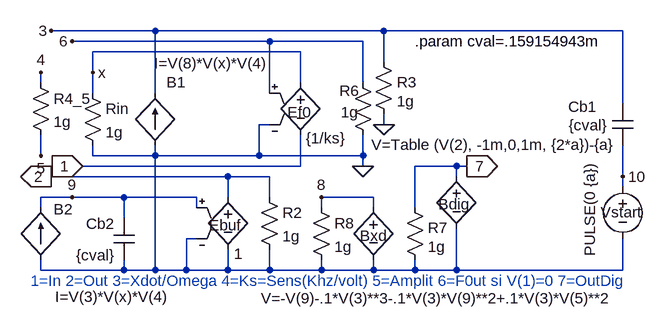
[diagram p0: schematic vcodig.asc]
vcodig.asc, the LTspice schematic file:
Version 4
SHEET 1 1184 680
WIRE -240 208 -240 192
WIRE -240 320 -240 288
WIRE -240 400 -240 384
WIRE -240 496 -240 480
WIRE -192 384 -240 384
WIRE -160 192 -160 160
WIRE -160 224 -160 192
WIRE -160 320 -160 304
WIRE -112 384 -192 384
WIRE -112 416 -112 384
WIRE -112 496 -240 496
WIRE -112 496 -112 480
WIRE -64 128 -224 128
WIRE -64 224 -64 128
WIRE -64 320 -160 320
WIRE -64 320 -64 304
WIRE -64 496 -112 496
WIRE -64 496 -64 320
WIRE -16 496 -64 496
WIRE -16 496 -16 448
WIRE 0 384 -112 384
WIRE 0 400 0 384
WIRE 0 448 -16 448
WIRE 48 352 -224 352
WIRE 48 384 48 352
WIRE 48 496 -16 496
WIRE 48 496 48 464
WIRE 96 320 -64 320
WIRE 96 320 96 272
WIRE 112 144 -192 144
WIRE 112 224 112 144
WIRE 112 272 96 272
WIRE 112 352 48 352
WIRE 112 384 112 352
WIRE 112 496 48 496
WIRE 112 496 112 464
WIRE 160 160 -160 160
WIRE 160 208 160 160
WIRE 160 336 -176 336
WIRE 160 336 160 288
WIRE 192 400 192 384
WIRE 192 496 112 496
WIRE 192 496 192 480
WIRE 256 144 112 144
WIRE 256 208 256 144
WIRE 256 320 96 320
WIRE 256 320 256 288
WIRE 256 336 256 320
WIRE 272 384 192 384
WIRE 272 400 272 384
WIRE 272 496 192 496
WIRE 272 496 272 480
WIRE 288 128 -64 128
WIRE 288 176 288 128
WIRE 288 272 288 256
WIRE 336 400 336 336
WIRE 336 496 272 496
WIRE 336 496 336 480
WIRE 400 336 336 336
WIRE 400 352 400 336
WIRE 400 496 336 496
WIRE 400 496 400 432
WIRE 416 336 400 336
WIRE 656 128 288 128
WIRE 656 240 656 128
WIRE 656 352 656 304
WIRE 656 368 656 352
WIRE 656 496 400 496
WIRE 656 496 656 448
FLAG 256 336 0
FLAG -176 336 1
IOPIN -176 336 In
FLAG -224 128 3
FLAG -192 384 9
FLAG 192 384 8
FLAG -224 352 2
IOPIN -224 352 Out
FLAG 656 352 10
FLAG -240 192 4
FLAG -240 320 5
FLAG -192 144 6
FLAG -160 192 x
FLAG 416 336 7
IOPIN 416 336 Out
FLAG 288 272 0
SYMBOL res -176 208 R0
SYMATTR InstName Rin
SYMATTR Value 1g
SYMBOL res 96 368 R0
SYMATTR InstName R2
SYMATTR Value 1g
SYMBOL bi -64 304 R180
WINDOW 0 -47 97 Left 0
WINDOW 3 -173 126 Left 0
SYMATTR InstName B1
SYMATTR Value I=V(8)*V(x)*V(4)
SYMBOL bi -240 480 R180
WINDOW 0 -49 78 Left 0
WINDOW 3 -197 -57 Left 0
SYMATTR InstName B2
SYMATTR Value I=V(3)*V(x)*V(4)
SYMBOL cap -128 416 R0
WINDOW 3 -58 57 Left 0
WINDOW 0 -42 9 Left 0
SYMATTR Value {cval}
SYMATTR InstName Cb2
SYMATTR SpiceLine Rpar=1g
SYMBOL bv 272 384 R0
WINDOW 0 -21 59 Left 0
WINDOW 3 -173 155 Left 0
SYMATTR InstName Bxd
SYMATTR Value V=-V(9)-.1*V(3)**3-.1*V(3)*V(9)**2+.1*V(3)*V(5)**2
SYMBOL res 176 384 R0
SYMATTR InstName R8
SYMATTR Value 1g
SYMBOL e 48 368 R0
WINDOW 0 -29 59 Left 0
WINDOW 3 9 103 Left 0
SYMATTR InstName Ebuf
SYMATTR Value 1
SYMBOL voltage 656 352 R0
WINDOW 0 -34 55 Left 0
WINDOW 3 -51 -22 VRight 0
WINDOW 123 0 0 Left 0
WINDOW 39 0 0 Left 0
SYMATTR InstName Vstart
SYMATTR Value PULSE(0 {a})
SYMBOL cap 640 240 R0
WINDOW 0 -68 5 Left 0
WINDOW 3 -8 33 Right 0
SYMATTR InstName Cb1
SYMATTR Value {cval}
SYMBOL res -256 192 R0
SYMATTR InstName R4_5
SYMATTR Value 1g
SYMBOL res 240 192 R0
WINDOW 0 -20 28 Left 0
WINDOW 3 -18 61 Left 0
SYMATTR InstName R6
SYMATTR Value 1g
SYMBOL e 160 192 R0
WINDOW 0 -20 61 Left 0
WINDOW 3 8 101 Left 0
SYMATTR InstName Ef0
SYMATTR Value {1/ks}
SYMBOL bv 400 336 R0
WINDOW 0 -28 59 Left 0
WINDOW 3 -131 -33 Left 0
SYMATTR InstName Bdig
SYMATTR Value V=Table (V(2), -1m,0,1m, {2*a})-{a}
SYMBOL res 320 384 R0
WINDOW 0 36 47 Left 0
SYMATTR InstName R7
SYMATTR Value 1g
SYMBOL res 272 160 R0
WINDOW 0 36 47 Left 0
SYMATTR InstName R3
SYMATTR Value 1g
TEXT -256 512 Left 0 ;1=In 2=Out 3=Xdot/Omega 4=Ks=Sens(Khz/volt) 5=Amplit 6=F0ut si V(1)=0 7=OutDig
TEXT 336 144 Left 0 !.param cval=.159154943m

The netlist it stands for:
* vcodig.asc
Rin x 0 1g
R2 2 0 1g
B1 0 3 I=V(8)*V(x)*V(4)
B2 0 9 I=V(3)*V(x)*V(4)
Cb2 9 0 {cval} Rpar=1g
Bxd 8 0 V=-V(9)-.1*V(3)**3-.1*V(3)*V(9)**2+.1*V(3)*V(5)**2
R8 8 0 1g
Ebuf 2 0 9 0 1
Vstart 10 0 PULSE(0 {a})
Cb1 3 10 {cval}
R4_5 4 5 1g
R6 6 0 1g
Ef0 x 1 6 0 {1/ks}
Bdig 7 0 V=Table (V(2), -1m,0,1m, {2*a})-{a}
R7 7 0 1g
R3 3 0 1g
* 1=In 2=Out 3=Xdot/Omega 4=Ks=Sens(Khz/volt) 5=Amplit 6=F0ut si V(1)=0 7=OutDig
.param cval=.159154943m
.backanno
.end